# EAGLE design SPIDER (EAGLE 9.6.0)
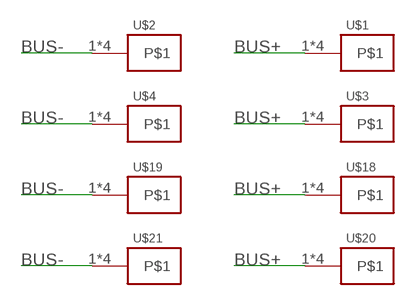
[diagram p0: schematic, sheet 1]

## Parts
U$1  KCONNECT-  [KCONNECT-]
U$2  KCONNECT-  [KCONNECT-]
U$3  KCONNECT-  [KCONNECT-]
U$4  KCONNECT-  [KCONNECT-]
U$18  KCONNECT-  [KCONNECT-]
U$19  KCONNECT-  [KCONNECT-]
U$20  KCONNECT-  [KCONNECT-]
U$21  KCONNECT-  [KCONNECT-]

## Nets
BUS+: U$1.1 U$1.2 U$1.3 U$1.4 U$3.1 U$3.2 U$3.3 U$3.4 U$18.1 U$18.2 U$18.3 U$18.4 U$20.1 U$20.2 U$20.3 U$20.4
BUS-: U$2.1 U$2.2 U$2.3 U$2.4 U$4.1 U$4.2 U$4.3 U$4.4 U$19.1 U$19.2 U$19.3 U$19.4 U$21.1 U$21.2 U$21.3 U$21.4

## Library data of the parts
U$1-U$4 U$18-U$21 = CanCubeSat:KCONNECT

## Board
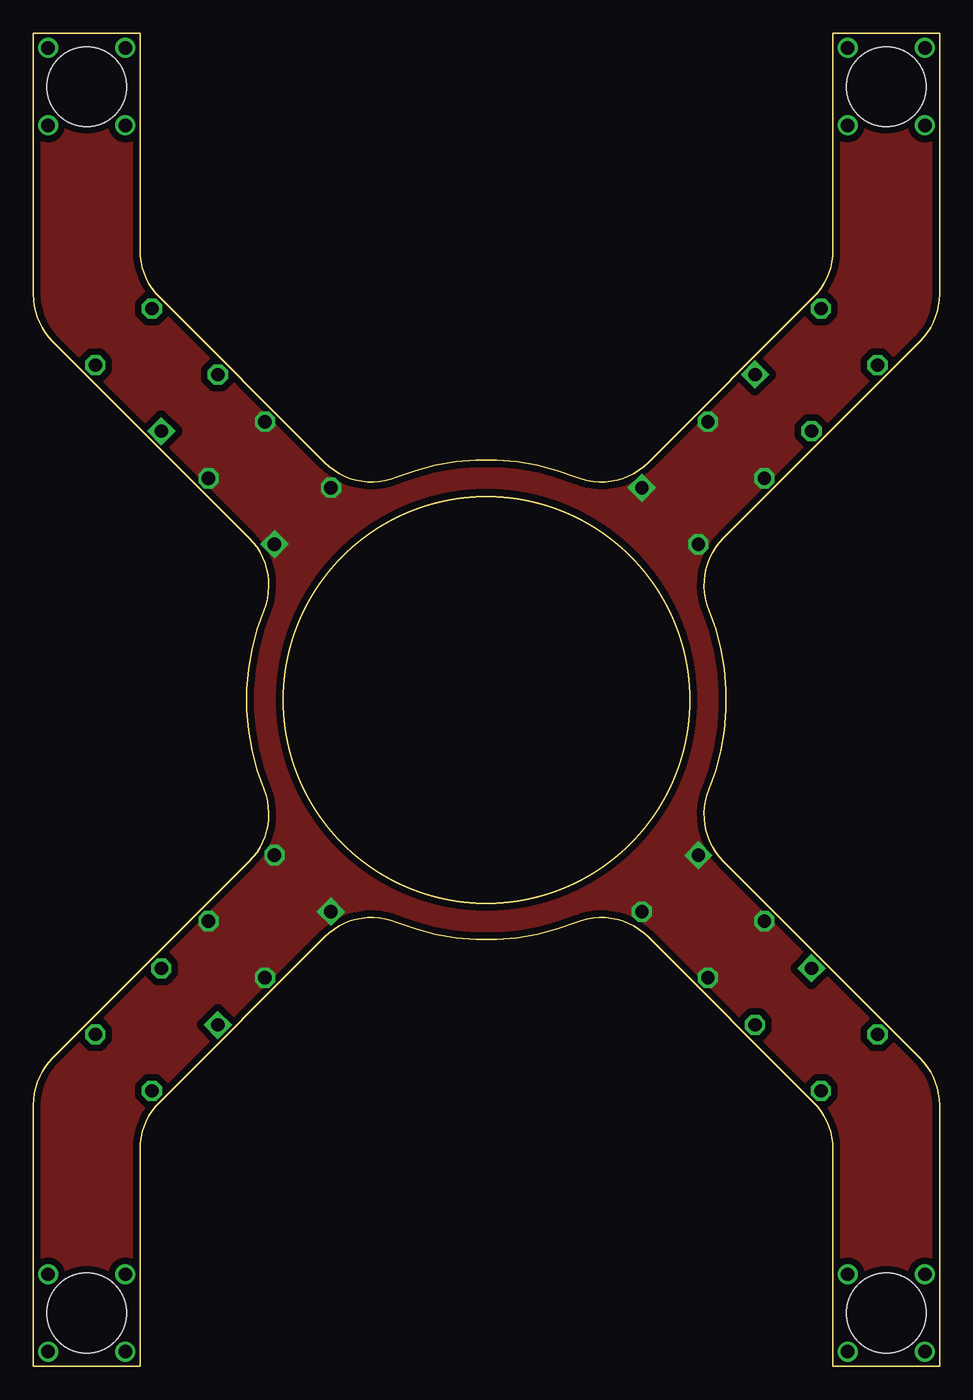
[diagram p1: board, top side]
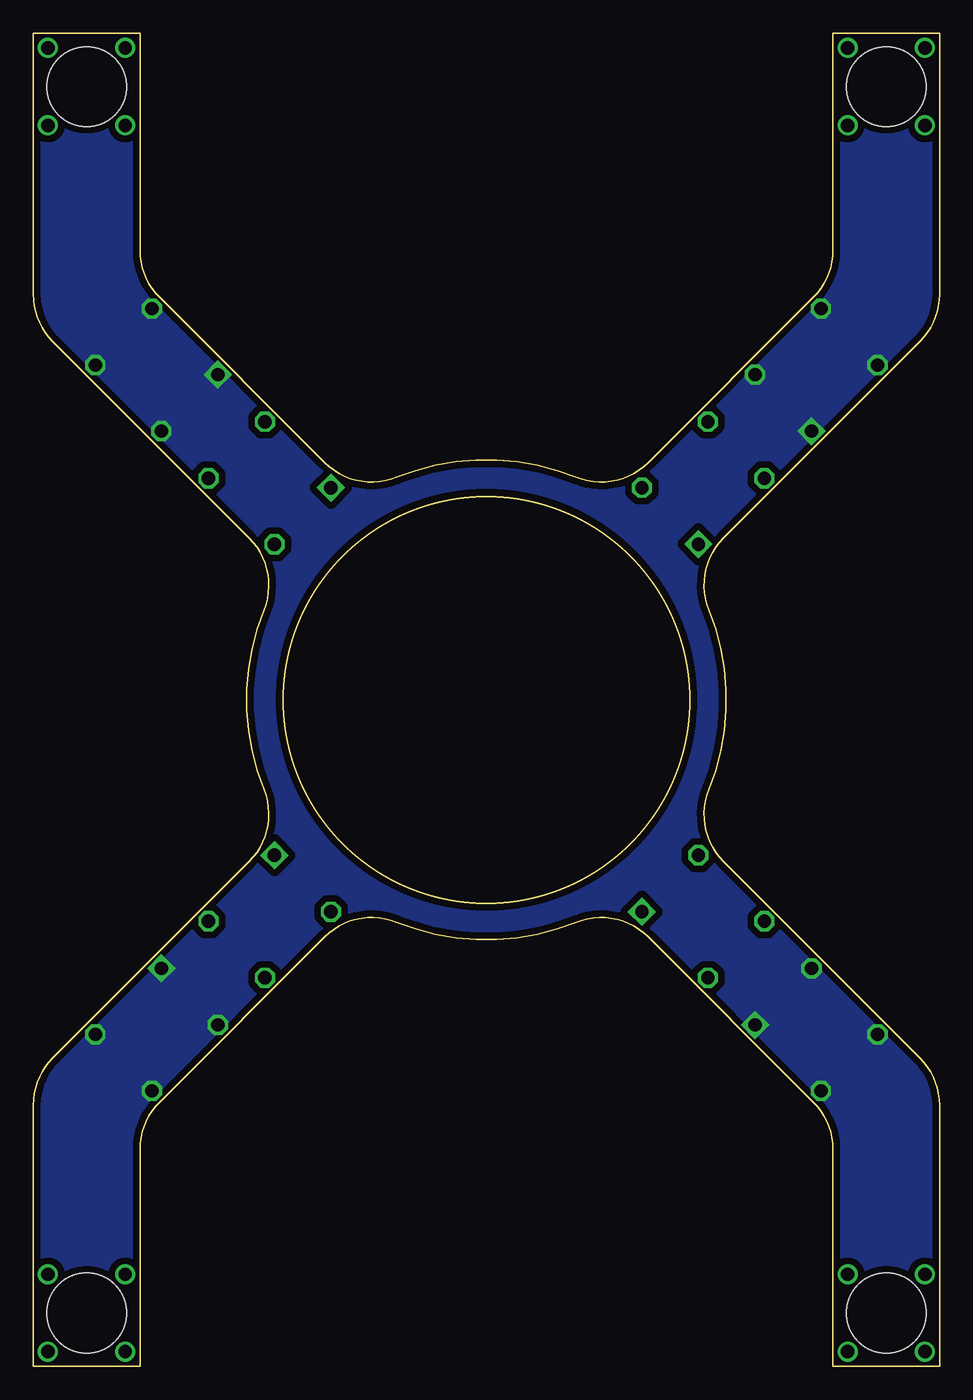
[diagram p2: board, bottom side, seen from below]

Size 68 x 100 mm. Coordinates in mm from the lower left corner, seen from the top.
Outline: 0,0 8,0 8,16.27 arc-45 9.46,19.81 21.86,32.2 arc-67 27.27,33.31 arc44 40.73,33.31 arc-67 46.14,32.2 58.54,19.81 arc-45 60,16.27 60,0 68,0 68,19.59 arc45 66.54,23.12 51.8,37.86 arc-67 50.69,43.27 arc44 50.69,56.73 arc-67 51.8,62.14 66.54,76.88 arc45 68,80.41 68,100 60,100 60,83.73 arc-45 58.54,80.19 46.14,67.8 arc-67 40.73,66.69 arc44 27.27,66.69 arc-67 21.86,67.8 9.46,80.19 arc-45 8,83.73 8,100 0,100 0,80.41 arc45 1.46,76.88 16.2,62.14 arc-67 17.31,56.73 arc44 17.31,43.27 arc-67 16.2,37.86 1.46,23.12 arc45 0,19.59 0,0
Outline: circle at 34,50 radius 15.25
Copper layers (1*16): Top 0.035mm / dielectric 1.5mm / Bottom 0.035mm
Design rules "default *": minimum track width 0.25mil, minimum drill 0.35mm, track to track 0.2mm, track to pad 0.2mm, pad to pad 0.2mm, via to via 0.2mm, smd to smd 0.2mm, copper to edge 0.19mm, drill to drill 0.1mm, minimum pad ring 10mil, minimum via ring 8mil, stop-mask expansion 4mil, vias tented up to drill 0mil, thermal gap 10mil
Holes 6 mm at 4,4 64,4 64,96 4,96

### Footprints (pad centres in the part's own frame; a part is rotated, then mirrored left to right if it is on the bottom)
KCONNECT- = drill 1 pad 1.4 square: 1 -3,-3.5 | drill 1 pad 1.4 octagon: 2 -3,3.5; 3 3,-3.5; 4 3,3.5

### Placement (x,y rotation side)
U$1  9.25,74.75 45 top
U$2  17.74,66.26 45 top
U$3  58.75,74.75 315 top
U$4  50.26,66.26 315 top
U$18  9.25,25.25 135 top
U$19  17.74,33.74 135 top
U$20  58.75,25.25 225 top
U$21  50.26,33.74 225 top

### Tracks (layer width: path | path; a pad name or v marks a point on that pad's centre or on a via)
BUS+
  pour Bottom (isolate 0.5, no thermals): 0,100 8,100 8,83.5 8.12,82.5 8.5,81.5 9.17,80.48 22.53,67.16 23.88,66.55 25.18,66.29 26.34,66.41 27.79,66.88 29.7,67.48 31.55,67.82 33.12,67.99 35.36,67.96 37.55,67.66 39.33,67.19 41.25,66.51 42.13,66.33 43.19,66.35 44.26,66.6 45.4,67.15 46.1,67.76 58.84,80.47 59.44,81.44 59.87,82.5 60,83.47 60.01,99.99 68,99.99 68,80.5 67.83,78.51 66.97,77.31 51.53,61.86 50.94,61.01 50.46,59.77 50.31,58.63 50.41,57.59 51,55.91 51.52,54.23 51.86,52.36 52,50.63 51.97,48.85 51.74,47 51.41,45.43 50.89,43.76 50.49,42.65 50.33,41.68 50.43,40.38 50.68,39.47 51.19,38.58 51.73,37.93 66.9,22.75 67.51,21.73 67.88,20.65 68.02,19.68 67.99,0.01 60,0 60,16.48 59.84,17.58 59.34,18.77 58.78,19.56 45.79,32.52 45.07,33.02 44.43,33.33 43.8,33.53 42.97,33.66 42.04,33.65 41.15,33.47 40.58,33.25 39.66,32.9 38.31,32.51 36.96,32.25 35.66,32.09 34.43,32 33.34,32 32.05,32.09 30.78,32.28 29.25,32.64 27.94,33.04 26.82,33.48 25.75,33.66 24.65,33.62 23.76,33.4 22.99,33.04 22.23,32.54 21.27,31.61 9.1,19.43 8.67,18.75 8.34,18.07 8.08,17.07 8,16.38 8,0 0.02,-0.01 0,19.48 0.08,20.58 0.44,21.63 0.94,22.52 1.61,23.27 3.12,24.76 16.43,38.08 16.83,38.62 17.21,39.29 17.5,40.06 17.65,40.98 17.66,41.88 17.51,42.75 17.11,43.76 16.53,45.69 16.23,47.15 16.04,48.76 16,50.51 16.12,52.02 16.32,53.4 16.53,54.35 16.86,55.49 17.25,56.59 17.55,57.42 17.69,58.7 17.49,59.93 17.16,60.8 16.75,61.51 16.22,62.13 1.26,77.1 0.53,78.16 0.1,79.27 -0.01,80.91
BUS-
  pour Top (isolate 0.5, no thermals): 0,100 8,100 8,83.5 8.12,82.5 8.5,81.5 9.17,80.48 22.53,67.16 23.88,66.55 25.18,66.29 26.34,66.41 27.79,66.88 29.7,67.48 31.55,67.82 33.12,67.99 35.36,67.96 37.55,67.66 39.33,67.19 41.25,66.51 42.13,66.33 43.19,66.35 44.26,66.6 45.4,67.15 46.1,67.76 58.84,80.47 59.44,81.44 59.87,82.5 60,83.47 60.01,99.99 68,99.99 68,80.5 67.83,78.51 66.97,77.31 51.53,61.86 50.94,61.01 50.46,59.77 50.31,58.63 50.41,57.59 51,55.91 51.52,54.23 51.86,52.36 52,50.63 51.97,48.85 51.74,47 51.41,45.43 50.89,43.76 50.49,42.65 50.33,41.68 50.43,40.38 50.68,39.47 51.19,38.58 51.73,37.93 66.9,22.75 67.51,21.73 67.88,20.65 68.02,19.68 67.99,0.01 60,0 60,16.48 59.84,17.58 59.34,18.77 58.78,19.56 45.79,32.52 45.07,33.02 44.43,33.33 43.8,33.53 42.97,33.66 42.04,33.65 41.15,33.47 40.58,33.25 39.66,32.9 38.31,32.51 36.96,32.25 35.66,32.09 34.43,32 33.34,32 32.05,32.09 30.78,32.28 29.25,32.64 27.94,33.04 26.82,33.48 25.75,33.66 24.65,33.62 23.76,33.4 22.99,33.04 22.23,32.54 21.27,31.61 9.1,19.43 8.67,18.75 8.34,18.07 8.08,17.07 8,16.38 8,0 0.02,-0.01 0,19.48 0.08,20.58 0.44,21.63 0.94,22.52 1.61,23.27 3.12,24.76 16.43,38.08 16.83,38.62 17.21,39.29 17.5,40.06 17.65,40.98 17.66,41.88 17.51,42.75 17.11,43.76 16.53,45.69 16.23,47.15 16.04,48.76 16,50.51 16.12,52.02 16.32,53.4 16.53,54.35 16.86,55.49 17.25,56.59 17.55,57.42 17.69,58.7 17.49,59.93 17.16,60.8 16.75,61.51 16.22,62.13 1.26,77.1 0.53,78.16 0.1,79.27 -0.01,80.91
N$4  (via drill 1)
  other vias: 1.1,6.9
N$5  (via drill 1)
  other vias: 1.1,1.1
N$6  (via drill 1)
  other vias: 6.9,1.1
N$7  (via drill 1)
  other vias: 6.9,6.9
N$10  (via drill 1)
  other vias: 61.1,6.9
N$11  (via drill 1)
  other vias: 61.1,1.1
N$12  (via drill 1)
  other vias: 66.9,1.1
N$13  (via drill 1)
  other vias: 66.9,6.9
N$14  (via drill 1)
  other vias: 61.1,98.9
N$15  (via drill 1)
  other vias: 61.1,93.1
N$16  (via drill 1)
  other vias: 66.9,93.1
N$17  (via drill 1)
  other vias: 66.9,98.9
N$18  (via drill 1)
  other vias: 1.1,98.9
N$19  (via drill 1)
  other vias: 1.1,93.1
N$20  (via drill 1)
  other vias: 6.9,93.1
N$21  (via drill 1)
  other vias: 6.9,98.9